# Altium schematic sheet EVA9720.SchDoc
size A4; PageSetup: Record=PageOptions|CenterHorizontal=True|CenterVertical=True|PrintScale=1.00|XCorrection=1.00|YCorrection=1.00|PrintKind=1|BorderSize=5000000|LeftOffset=0|BottomOffset=0|Orientation=2|PaperLength=1000|PaperWidth=1000|Scale=100|PaperSource=7|PrintQuality=600|MediaType=1|DitherType=10|PrintScaleMode=1|PaperKind=A4|PaperIndex=9
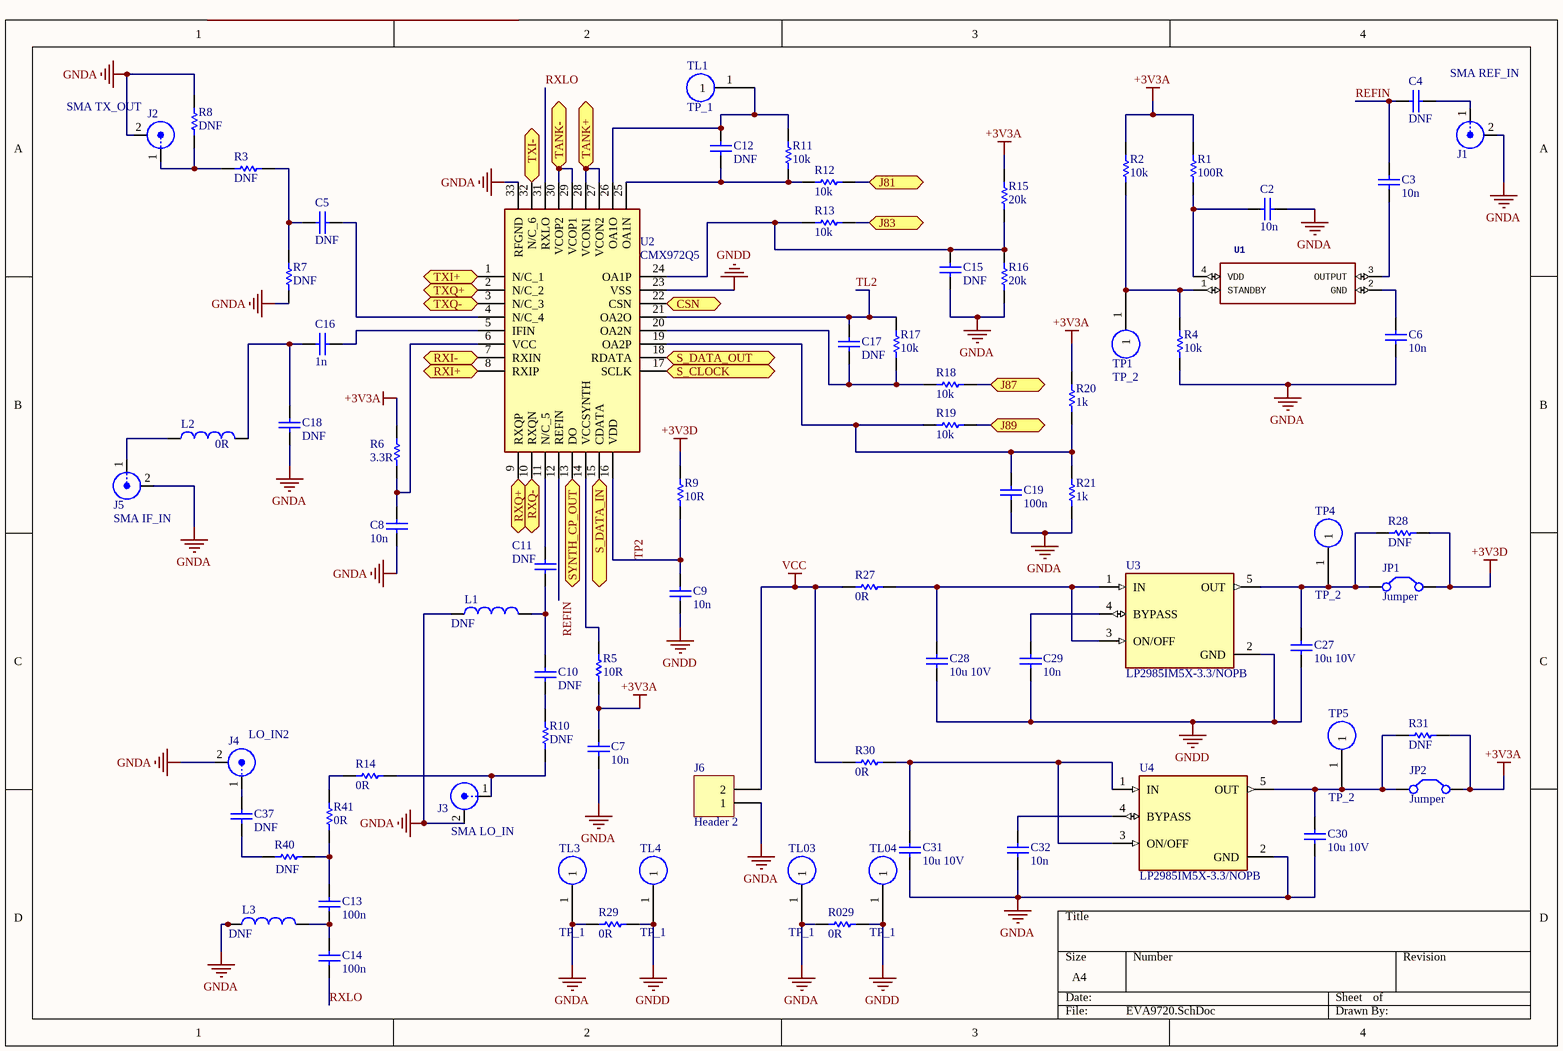
[diagram p0: EVA9720.SchDoc]

## Parts
C2  value 10n  [0805]  (hidden comment: Cap_0805)
C3  value 10n  [0805]  (hidden comment: Cap_0805)
C4  value DNF  [0805]  (hidden comment: Cap_0805)
C5  value DNF  [0805]  (hidden comment: Cap_0805)
C6  value 10n  [0805]  (hidden comment: Cap_0805)
C7  value 10n  [0805]  (hidden comment: Cap_0805)
C8  value 10n  [0805]  (hidden comment: Cap_0805)
C9  value 10n  [0805]  (hidden comment: Cap_0805)
C10  value DNF  [0805]  (hidden comment: Cap_0805)
C11  value DNF  [0805]  (hidden comment: Cap_0805)
C12  value DNF  [0805]  (hidden comment: Cap_0805)
C13  value 100n  [0805]  (hidden comment: Cap_0805)
C14  value 100n  [0805]  (hidden comment: Cap_0805)
C15  value DNF  [0805]  (hidden comment: Cap_0805)
C16  value 1n  [0805]  (hidden comment: Cap_0805)
C17  value DNF  [0805]  (hidden comment: Cap_0805)
C18  value DNF  [0805]  (hidden comment: Cap_0805)
C19  value 100n  [0805]  (hidden comment: Cap_0805)
C27  value 10u 10V  [1210]  (hidden comment: Cap_0805)
C28  value 10u 10V  [1210]  (hidden comment: Cap_0805)
C29  value 10n  [0805]  (hidden comment: Cap_0805)
C30  value 10u 10V  [1210]  (hidden comment: Cap_0805)
C31  value 10u 10V  [1210]  (hidden comment: Cap_0805)
C32  value 10n  [0805]  (hidden comment: Cap_0805)
C37  value DNF  [0805]  (hidden comment: Cap_0805)
J1  SMA REF_IN  [SMA_RA_DIP]
J2  SMA TX_OUT  [SMA_RA_DIP]
J3  SMA LO_IN  [SMA_RA_DIP]
J4  LO_IN2  [SMA_RA_DIP]
J5  SMA IF_IN  [SMA_RA_DIP]
J6  Header 2  [Klemens_Terminal_2P]
JP1  Jumper  [RAD-0.2]
JP2  Jumper  [RAD-0.2]
L1  DNF  [0805]
L2  0R  [1210]
L3  DNF  [0805]
R1  value 100R  [0805]  (hidden comment: Res_0805)
R2  value 10k  [0805]  (hidden comment: Res_0805)
R3  value DNF  [0805]  (hidden comment: Res_0805)
R4  value 10k  [0805]  (hidden comment: Res_0805)
R5  value 10R  [0805]  (hidden comment: Res_0805)
R6  value 3.3R  [0805]  (hidden comment: Res_0805)
R7  value DNF  [0805]  (hidden comment: Res_0805)
R8  value DNF  [0805]  (hidden comment: Res_0805)
R9  value 10R  [0805]  (hidden comment: Res_0805)
R10  value DNF  [0805]  (hidden comment: Res_0805)
R11  value 10k  [0805]  (hidden comment: Res_0805)
R12  value 10k  [0805]  (hidden comment: Res_0805)
R13  value 10k  [0805]  (hidden comment: Res_0805)
R14  value 0R  [0805]  (hidden comment: Res_0805)
R15  value 20k  [0805]  (hidden comment: Res_0805)
R16  value 20k  [0805]  (hidden comment: Res_0805)
R17  value 10k  [0805]  (hidden comment: Res_0805)
R18  value 10k  [0805]  (hidden comment: Res_0805)
R19  value 10k  [0805]  (hidden comment: Res_0805)
R20  value 1k  [0805]  (hidden comment: Res_0805)
R21  value 1k  [0805]  (hidden comment: Res_0805)
R27  value 0R  [0805]  (hidden comment: Res_0805)
R28  value DNF  [0805]  (hidden comment: Res_0805)
R29  value 0R  [0805]  (hidden comment: Res_0805)
R029  value 0R  [0805]  (hidden comment: Res_0805)
R30  value 0R  [0805]  (hidden comment: Res_0805)
R31  value DNF  [0805]  (hidden comment: Res_0805)
R40  value DNF  [0805]  (hidden comment: Res_0805)
R41  value 0R  [0805]  (hidden comment: Res_0805)
TL1  TP_1  [test_point]
TL3  TP_1  [test_point]
TL03  TP_1  [test_point]
TL4  TP_1  [test_point]
TL04  TP_1  [test_point]
TP1  TP_2  [test_point]
TP4  TP_2  [test_point]
TP5  TP_2  [test_point]
U1  19.2 MHz XO (Standard) CMOS Oscillator 1.8V ~ 3.3V Standby (Power Down) 4-SMD, No Lead   Source:  Datasheet  [ASEMB]  (value not drawn)
U2  CMX972Q5  [QFN50P500X500X100-33N-D]
U3  LP2985IM5X-3.3/NOPB  [SOT95P280X145-5N]
U4  LP2985IM5X-3.3/NOPB  [SOT95P280X145-5N]

## Ports
CSN (bidir), J81 (bidir), J83 (bidir), J87 (bidir), J89 (bidir), RXI+ (bidir), RXI- (bidir), RXQ+ (bidir), RXQ- (bidir), S_CLOCK (bidir), S_DATA_IN, S_DATA_OUT (bidir), SYNTH_CP_OUT (bidir), TANK+, TANK-, TXI+ (bidir), TXI- (bidir), TXQ+ (bidir), TXQ- (bidir)

## Nets
+3V3A: C7.1 JP2.2(C2) R1.2 R2.2 R5.2 R6.1 R15.1 R20.1 R31.2
+3V3D: JP1.2(C2) R9.1 R28.2
GNDA: C2.2 C6.1 C7.2 C8.1 C15.1 C18.1 C19.1 C30.1 C31.1 C32.1 J1.2(Y) J2.2(Y) J3.2(Y) J4.2(Y) J5.2(Y) J6.1 L1.1 L3.1 R4.1 R7.2 R8.1 R16.2 R21.1 R29.1 R029.1 TL3.1 TL03.1 U2.33(RFGND) U4.2(GND)
GNDD: C9.1 C27.1 C28.1 C29.1 R29.2 R029.2 TL4.1 TL04.1 U2.23(VSS) U3.2(GND)
VCC: J6.2 R27.1 R30.1
CSN: U2.22(CSN) ; port CSN
J81: R12.2 ; port J81
J83: R13.2 ; port J83
J87: R18.1 ; port J87
J89: R19.1 ; port J89
REFIN: C3.2 C4.1 U2.12(REFIN)
RXI+: U2.8(RXIP) ; port RXI+
RXI-: U2.7(RXIN) ; port RXI-
RXLO: C14.1 U2.31(RXLO)
RXQ+: U2.9(RXQP) ; port RXQ+
RXQ-: U2.10(RXQN) ; port RXQ-
S_CLOCK: U2.17(SCLK) ; port S_CLOCK
S_DATA_IN: U2.15(CDATA) ; port S_DATA_IN
S_DATA_OUT: U2.18(RDATA) ; port S_DATA_OUT
SYNTH_CP_OUT: U2.13(DO) ; port SYNTH_CP_OUT
TANK+: U2.27(VCON2) U2.28(VCON1) ; port TANK+
TANK-: U2.29(VCOP1) U2.30(VCOP2) ; port TANK-
TL2: C17.2 R17.1 U2.21(OA2O)
TP2: C9.2 R9.2 U2.16(VDD)
TXI+: U2.1(N/C_1) ; port TXI+
TXI-: U2.32(N/C_6) ; port TXI-
TXQ+: U2.2(N/C_2) ; port TXQ+
TXQ-: U2.3(N/C_3) ; port TXQ-
NetC2_1: C2.1 R1.1 U1.4(VDD)
NetC3_1: C3.1 U1.3(OUTPUT)
NetC4_2: C4.2 J1.1(X)
NetC5_1: C5.1 R3.2 R7.1
NetC5_2: C5.2 U2.4(N/C_4)
NetC6_2: C6.2 U1.2(GND)
NetC8_2: C8.2 R6.2 U2.6(VCC)
NetC10_1: C10.1 R10.1
NetC10_2: C10.2 C11.2 L1.2
NetC11_1: C11.1 U2.11(N/C_5)
NetC12_1: C12.1 R11.2 R12.1 U2.25(OA1N)
NetC12_2: C12.2 R11.1 TL1.1 U2.26(OA1O)
NetC13_1: C13.1 C14.2 L3.2
NetC13_2: C13.2 R40.2 R41.1
NetC15_2: C15.2 R13.1 R15.2 R16.1 U2.24(OA1P)
NetC16_1: C16.1 C18.2 L2.2
NetC16_2: C16.2 U2.5(IFIN)
NetC17_1: C17.1 R17.2 R18.2 U2.20(OA2N)
NetC19_2: C19.2 R19.2 R20.2 R21.2 U2.19(OA2P)
NetC27_2: C27.2 JP1.1(C1) R28.1 TP4.1 U3.5(OUT)
NetC28_2: C28.2 R27.2 U3.1(IN) U3.3(ON/OFF)
NetC29_2: C29.2 U3.4(BYPASS)
NetC30_2: C30.2 JP2.1(C1) R31.1 TP5.1 U4.5(OUT)
NetC31_2: C31.2 R30.2 U4.1(IN) U4.3(ON/OFF)
NetC32_2: C32.2 U4.4(BYPASS)
NetC37_1: C37.1 J4.1(X)
NetC37_2: C37.2 R40.1
NetJ2_1: J2.1(X) R3.1 R8.2
NetJ3_1: J3.1(X) R10.2 R14.2
NetJ5_1: J5.1(X) L2.1
NetR2_1: R2.1 R4.2 TP1.1 U1.1(STANDBY)
NetR5_1: R5.1 U2.14(VCCSYNTH)
NetR14_1: R14.1 R41.2

## Library data of the parts
C2-C19 C27-C32 C37 = Cap_0805: ABE_Capacitor; Ozdisan Link: *; Ozdisan P/N: *; DigiKey P/N: *; DigiKey Link: *; Package: 0805
J1-J5 = SMA Right Angle Connector
J6 = Header 2: Header, 2-Pin; LatestRevisionDate: 17-Jul-2002; LatestRevisionNote: Re-released for DXP Platform.; Publisher: Altium Limited
JP1 JP2 = Jumper: Jumper Wire; Published: 24-Mar-1999; LatestRevisionDate: 17-Jul-2002; LatestRevisionNote: Re-released for DXP Platform.; PackageReference: RAD-0.2; Publisher: Altium Limited; PackageDescription: Radial Cap, Thru-Hole; 2 Leads; 0.2 in Pin Spacing
L1-L3 = 28F0121-0SR-10: Laird Technologies Ferrite Bead, 3.05 x 2.54 x 4.06mm (2030 (5030M)), 30 impedance at 25 MHz; Geometry.Height: 3.05mm; Mouser Part Number: N/A; Mouser Price/Stock: https://www.mouser.co.uk/ProductDetail/Laird/28F0121-0SR-10?qs=PzGy0jfpSMvqclEvolMrsg%3D%3D; Manufacturer_Name: Laird Technologies; Manufacturer_Part_Number: 28F0121-0SR-10; Datasheet Link: https://datasheet.datasheetarchive.com/originals/distributors/Datasheets-DGA6/557085.pdf
R1-R21 R27-R29 R029-R31 R40 R41 = Res_0805: ABE_Resistor; Ozdisan Link: *; Ozdisan P/N: *; DigiKey P/N: *; DigiKey Link: *; Package: 0805
TL1 TL3 TL03 TL4 TL04 TP1 TP4 TP5 = test_point: Testpoint1: *
U1 = ASEMB-19.200MHZ-LY-T: Manufacturer_Name: ABRACON; GateName_1: G$1; SymbolName_1: ASEMB-19.200MHZ-LY-T; LibraryName: ASEMB-19.200MHZ-LY-T; DeviceSetName: ASEMB-19.200MHZ-LY-T; Mouser_Part_Number: 815-ASEMB-19.2-LY-T; Mouser_Price-Stock: https://www.mouser.co.uk/ProductDetail/ABRACON/ASEMB-19200MHZ-LY-T?qs=CnD89xF1VSneIw%252BqWln2TQ%3D%3D; Manufacturer_Part_Number: ASEMB-19.200MHZ-LY-T; Height: 0.9mm
U2 = CMX972Q5: Modulator / Demodulator Quadrature Demoduator IF PLL VCO; Manufacturer_Name: CML Micro; Geometry.Height: 1mm; Mouser Part Number: 226-CMX972Q5; Mouser Price/Stock: https://www.mouser.co.uk/ProductDetail/CML-Microcircuits/CMX972Q5/?qs=unwgFEO1A6vu77Vi8uFupQ%3D%3D; Manufacturer_Part_Number: CMX972Q5; Datasheet Link: https://www.cmlmicro.com/wp-content/uploads/2017/10/CMX972-data-sheet.pdf
U3 U4 = LP2985IM5X-3.3/NOPB: 150-mA, 16-V, low-dropout voltage regulator with enable 5-SOT-23 -40 to 125; Value: *; Availability: Unavailable; Package: None; MP: LP2985IM5X-3.3/NOPB; Price: None